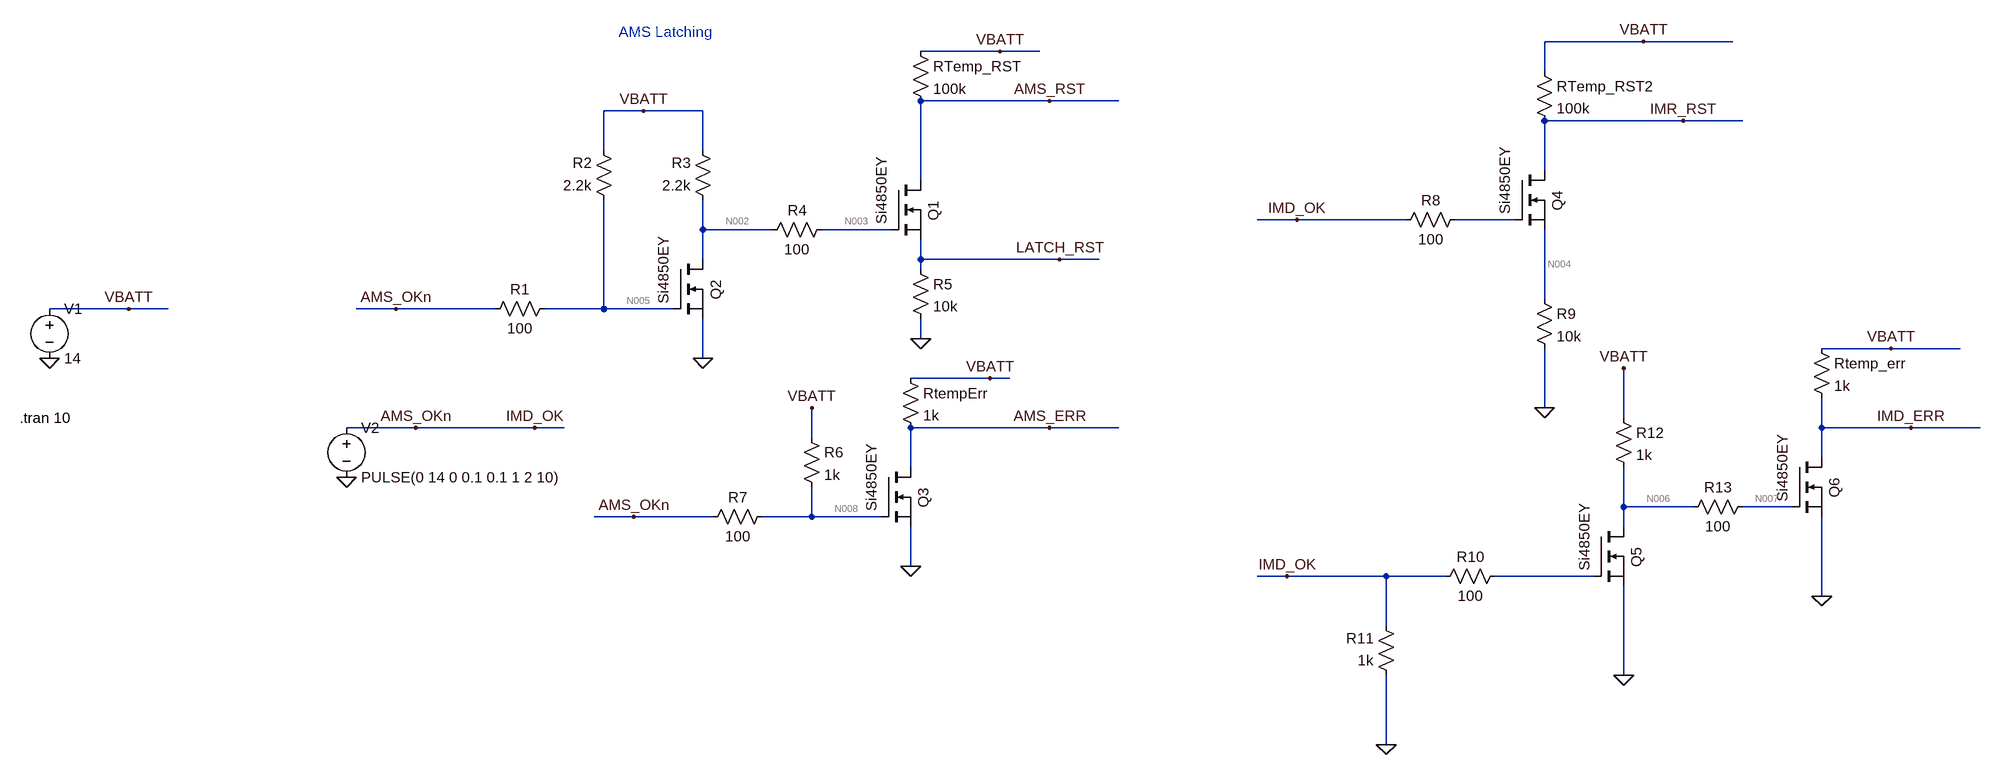
[diagram p0: schematic Latching.asc]
Latching.asc, the LTspice schematic file:
Version 4
SHEET 1 2244 900
WIRE 1696 -256 1536 -256
WIRE 1840 -256 1696 -256
WIRE 656 -240 528 -240
WIRE 720 -240 656 -240
WIRE 1536 -208 1536 -256
WIRE 736 -160 528 -160
WIRE 848 -160 736 -160
WIRE 80 -144 16 -144
WIRE 176 -144 80 -144
WIRE 1760 -128 1536 -128
WIRE 1856 -128 1760 -128
WIRE 16 -80 16 -144
WIRE 176 -80 176 -144
WIRE 1536 -48 1536 -128
WIRE 528 -32 528 -160
WIRE 1136 32 1072 32
WIRE 1312 32 1136 32
WIRE 1488 32 1392 32
WIRE 176 48 176 0
WIRE 288 48 176 48
WIRE 480 48 368 48
WIRE 176 96 176 48
WIRE 528 96 528 64
WIRE 752 96 528 96
WIRE 816 96 752 96
WIRE 528 112 528 96
WIRE 1536 160 1536 48
WIRE -752 176 -880 176
WIRE -688 176 -752 176
WIRE -320 176 -384 176
WIRE -160 176 -320 176
WIRE 16 176 16 0
WIRE 16 176 -80 176
WIRE 128 176 16 176
WIRE 528 224 528 192
WIRE 2096 240 1984 240
WIRE 2208 240 2096 240
WIRE 176 256 176 192
WIRE 640 288 512 288
WIRE 672 288 640 288
WIRE 1536 336 1536 240
WIRE 1664 352 1664 272
WIRE -288 368 -400 368
WIRE -96 368 -288 368
WIRE -48 368 -96 368
WIRE 736 368 512 368
WIRE 848 368 736 368
WIRE 1984 368 1984 320
WIRE 2128 368 1984 368
WIRE 2240 368 2128 368
WIRE 352 384 352 336
WIRE 1984 416 1984 368
WIRE 512 432 512 368
WIRE 1664 496 1664 432
WIRE 1776 496 1664 496
WIRE 1936 496 1856 496
WIRE 64 512 0 512
WIRE 192 512 64 512
WIRE 352 512 352 464
WIRE 352 512 272 512
WIRE 464 512 352 512
WIRE 1664 528 1664 496
WIRE 512 592 512 528
WIRE 1120 608 1072 608
WIRE 1280 608 1120 608
WIRE 1376 608 1280 608
WIRE 1616 608 1456 608
WIRE 1984 640 1984 512
WIRE 1280 688 1280 608
WIRE 1664 768 1664 624
WIRE 1280 880 1280 768
FLAG 176 256 0
FLAG 528 224 0
FLAG 512 592 0
FLAG -880 256 0
FLAG 352 336 VBATT
FLAG 752 96 LATCH_RST
FLAG 736 368 AMS_ERR
FLAG 736 -160 AMS_RST
FLAG 656 -240 VBATT
FLAG 640 288 VBATT
FLAG -320 176 AMS_OKn
FLAG 64 512 AMS_OKn
FLAG -400 448 0
FLAG -288 368 AMS_OKn
FLAG 80 -144 VBATT
FLAG -752 176 VBATT
FLAG 1536 336 0
FLAG 1664 768 0
FLAG 1280 880 0
FLAG 1984 640 0
FLAG 1696 -256 VBATT
FLAG 2096 240 VBATT
FLAG 1664 272 VBATT
FLAG 1136 32 IMD_OK
FLAG 1120 608 IMD_OK
FLAG 2128 368 IMD_ERR
FLAG 1760 -128 IMR_RST
FLAG -96 368 IMD_OK
SYMBOL res -64 160 R90
WINDOW 0 0 56 VBottom 2
WINDOW 3 32 56 VTop 2
SYMATTR InstName R1
SYMATTR Value 100
SYMBOL res 32 16 R180
WINDOW 0 36 76 Left 2
WINDOW 3 36 40 Left 2
SYMATTR InstName R2
SYMATTR Value 2.2k
SYMBOL res 192 16 R180
WINDOW 0 36 76 Left 2
WINDOW 3 36 40 Left 2
SYMATTR InstName R3
SYMATTR Value 2.2k
SYMBOL res 272 64 R270
WINDOW 0 32 56 VTop 2
WINDOW 3 0 56 VBottom 2
SYMATTR InstName R4
SYMATTR Value 100
SYMBOL res 512 96 R0
SYMATTR InstName R5
SYMATTR Value 10k
SYMBOL res 336 368 R0
SYMATTR InstName R6
SYMATTR Value 1k
SYMBOL res 288 496 R90
WINDOW 0 0 56 VBottom 2
WINDOW 3 32 56 VTop 2
SYMATTR InstName R7
SYMATTR Value 100
SYMBOL voltage -880 160 R0
WINDOW 123 0 0 Left 0
WINDOW 39 0 0 Left 0
SYMATTR InstName V1
SYMATTR Value 14
SYMBOL res 496 272 R0
SYMATTR InstName RtempErr
SYMATTR Value 1k
SYMBOL res 512 -256 R0
SYMATTR InstName RTemp_RST
SYMATTR Value 100k
SYMBOL voltage -400 352 R0
WINDOW 123 0 0 Left 0
WINDOW 39 0 0 Left 0
SYMATTR InstName V2
SYMATTR Value PULSE(0 14 0 0.1 0.1 1 2 10)
SYMBOL nmos 128 96 R0
WINDOW 0 53 50 VTop 2
WINDOW 3 -16 72 VLeft 2
SYMATTR InstName Q2
SYMATTR Value Si4850EY
SYMBOL nmos 480 -32 R0
WINDOW 0 53 50 VTop 2
WINDOW 3 -16 72 VLeft 2
SYMATTR InstName Q1
SYMATTR Value Si4850EY
SYMBOL nmos 464 432 R0
WINDOW 0 53 50 VTop 2
WINDOW 3 -16 72 VLeft 2
SYMATTR InstName Q3
SYMATTR Value Si4850EY
SYMBOL res 1408 16 R90
WINDOW 0 0 56 VBottom 2
WINDOW 3 32 56 VTop 2
SYMATTR InstName R8
SYMATTR Value 100
SYMBOL nmos 1488 -48 R0
WINDOW 0 53 50 VTop 2
WINDOW 3 -16 72 VLeft 2
SYMATTR InstName Q4
SYMATTR Value Si4850EY
SYMBOL res 1520 144 R0
SYMATTR InstName R9
SYMATTR Value 10k
SYMBOL res 1472 592 R90
WINDOW 0 0 56 VBottom 2
WINDOW 3 32 56 VTop 2
SYMATTR InstName R10
SYMATTR Value 100
SYMBOL res 1296 784 R180
WINDOW 0 36 76 Left 2
WINDOW 3 36 40 Left 2
SYMATTR InstName R11
SYMATTR Value 1k
SYMBOL nmos 1616 528 R0
WINDOW 0 53 50 VTop 2
WINDOW 3 -16 72 VLeft 2
SYMATTR InstName Q5
SYMATTR Value Si4850EY
SYMBOL res 1648 336 R0
SYMATTR InstName R12
SYMATTR Value 1k
SYMBOL res 1872 480 R90
WINDOW 0 0 56 VBottom 2
WINDOW 3 32 56 VTop 2
SYMATTR InstName R13
SYMATTR Value 100
SYMBOL nmos 1936 416 R0
WINDOW 0 53 50 VTop 2
WINDOW 3 -16 72 VLeft 2
SYMATTR InstName Q6
SYMATTR Value Si4850EY
SYMBOL res 1968 224 R0
SYMATTR InstName Rtemp_err
SYMATTR Value 1k
SYMBOL res 1520 -224 R0
SYMATTR InstName RTemp_RST2
SYMATTR Value 100k
TEXT -928 352 Left 2 !.tran 10
TEXT 40 -272 Left 2 ;AMS Latching

The netlist it stands for:
* Latching.asc
R1 N005 IMD_OK 100
R2 N005 VBATT 2.2k
R3 N002 VBATT 2.2k
R4 N002 N003 100
R5 LATCH_RST 0 10k
R6 VBATT N008 1k
R7 N008 IMD_OK 100
V1 VBATT 0 14
RtempErr VBATT AMS_ERR 1k
RTemp_RST VBATT AMS_RST 100k
V2 IMD_OK 0 PULSE(0 14 0 0.1 0.1 1 2 10)
M§Q2 N002 N005 0 0 Si4850EY
M§Q1 AMS_RST N003 LATCH_RST LATCH_RST Si4850EY
M§Q3 AMS_ERR N008 0 0 Si4850EY
R8 N001 IMD_OK 100
M§Q4 IMR_RST N001 N004 N004 Si4850EY
R9 N004 0 10k
R10 N009 IMD_OK 100
R11 0 IMD_OK 1k
M§Q5 N006 N009 0 0 Si4850EY
R12 VBATT N006 1k
R13 N007 N006 100
M§Q6 IMD_ERR N007 0 0 Si4850EY
Rtemp_err VBATT IMD_ERR 1k
RTemp_RST2 VBATT IMR_RST 100k
.model NMOS NMOS
.model PMOS PMOS
.lib standard.mos
.tran 10
* AMS Latching
.backanno
.end

* Results of the author's LTspice run, read from the files saved beside the schematic
* Operating Point, zero values left out:
*   V(n005) = 608.7 mV
*   V(vbatt) = 14 V
*   V(n002) = 14 V
*   V(n003) = 14 V
*   V(latch_rst) = 1.273 V
*   V(n008) = 1.273 V
*   V(ams_err) = 14 V
*   V(ams_rst) = 1.273 V
*   V(imr_rst) = 14 V
*   V(n004) = 640 nV
*   V(n006) = 14 V
*   V(n007) = 14 V
*   V(imd_err) = 328.1 µV
*   Id(Q6) = 14 mA
*   Is(Q6) = -14 mA
*   Id(Q5) = 49.97 pA
*   Is(Q5) = -49.97 pA
*   Id(Q4) = 49.97 pA
*   Is(Q4) = -49.97 pA
*   Id(Q3) = 115.6 nA
*   Is(Q3) = -115.6 nA
*   Id(Q1) = 127.3 µA
*   Is(Q1) = -127.3 µA
*   Id(Q2) = 50.16 pA
*   Is(Q2) = -50.16 pA
*   I(Rtemp_rst2) = 64.1 pA
*   I(Rtemp_err) = 14 mA
*   I(R12) = 63.88 pA
*   I(R9) = 64 pA
*   I(Rtemp_rst) = 127.3 µA
*   I(Rtemperr) = 115.6 nA
*   I(R7) = 12.73 mA
*   I(R6) = 12.73 mA
*   I(R5) = 127.3 µA
*   I(R3) = -64.35 pA
*   I(R2) = -6.087 mA
*   I(R1) = 6.087 mA
*   I(V2) = 18.81 mA
*   I(V1) = -32.94 mA
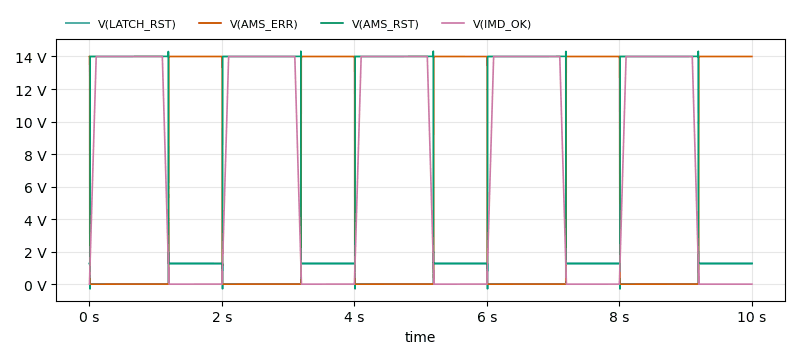
[diagram p1: Transient Analysis of Latching.asc, plotted from the saved traces]
* Transient Analysis, 1 run:
*   V(LATCH_RST): min -287.3 mV, max 2.014 V, average 520.6 mV, rms 814 mV, last 1.273 V
*   V(AMS_ERR): min 328.1 µV, max 14 V, average 5.659 V, rms 8.898 V, last 14 V
*   V(AMS_RST): min 828.8 mV, max 14.32 V, average 8.794 V, rms 10.79 V, last 1.273 V
*   V(IMD_OK): min 0 V, max 14 V, average 7.7 V, rms 10.24 V, last 0 V